# EAGLE design DDS_rev02 (EAGLE 6.5.0)
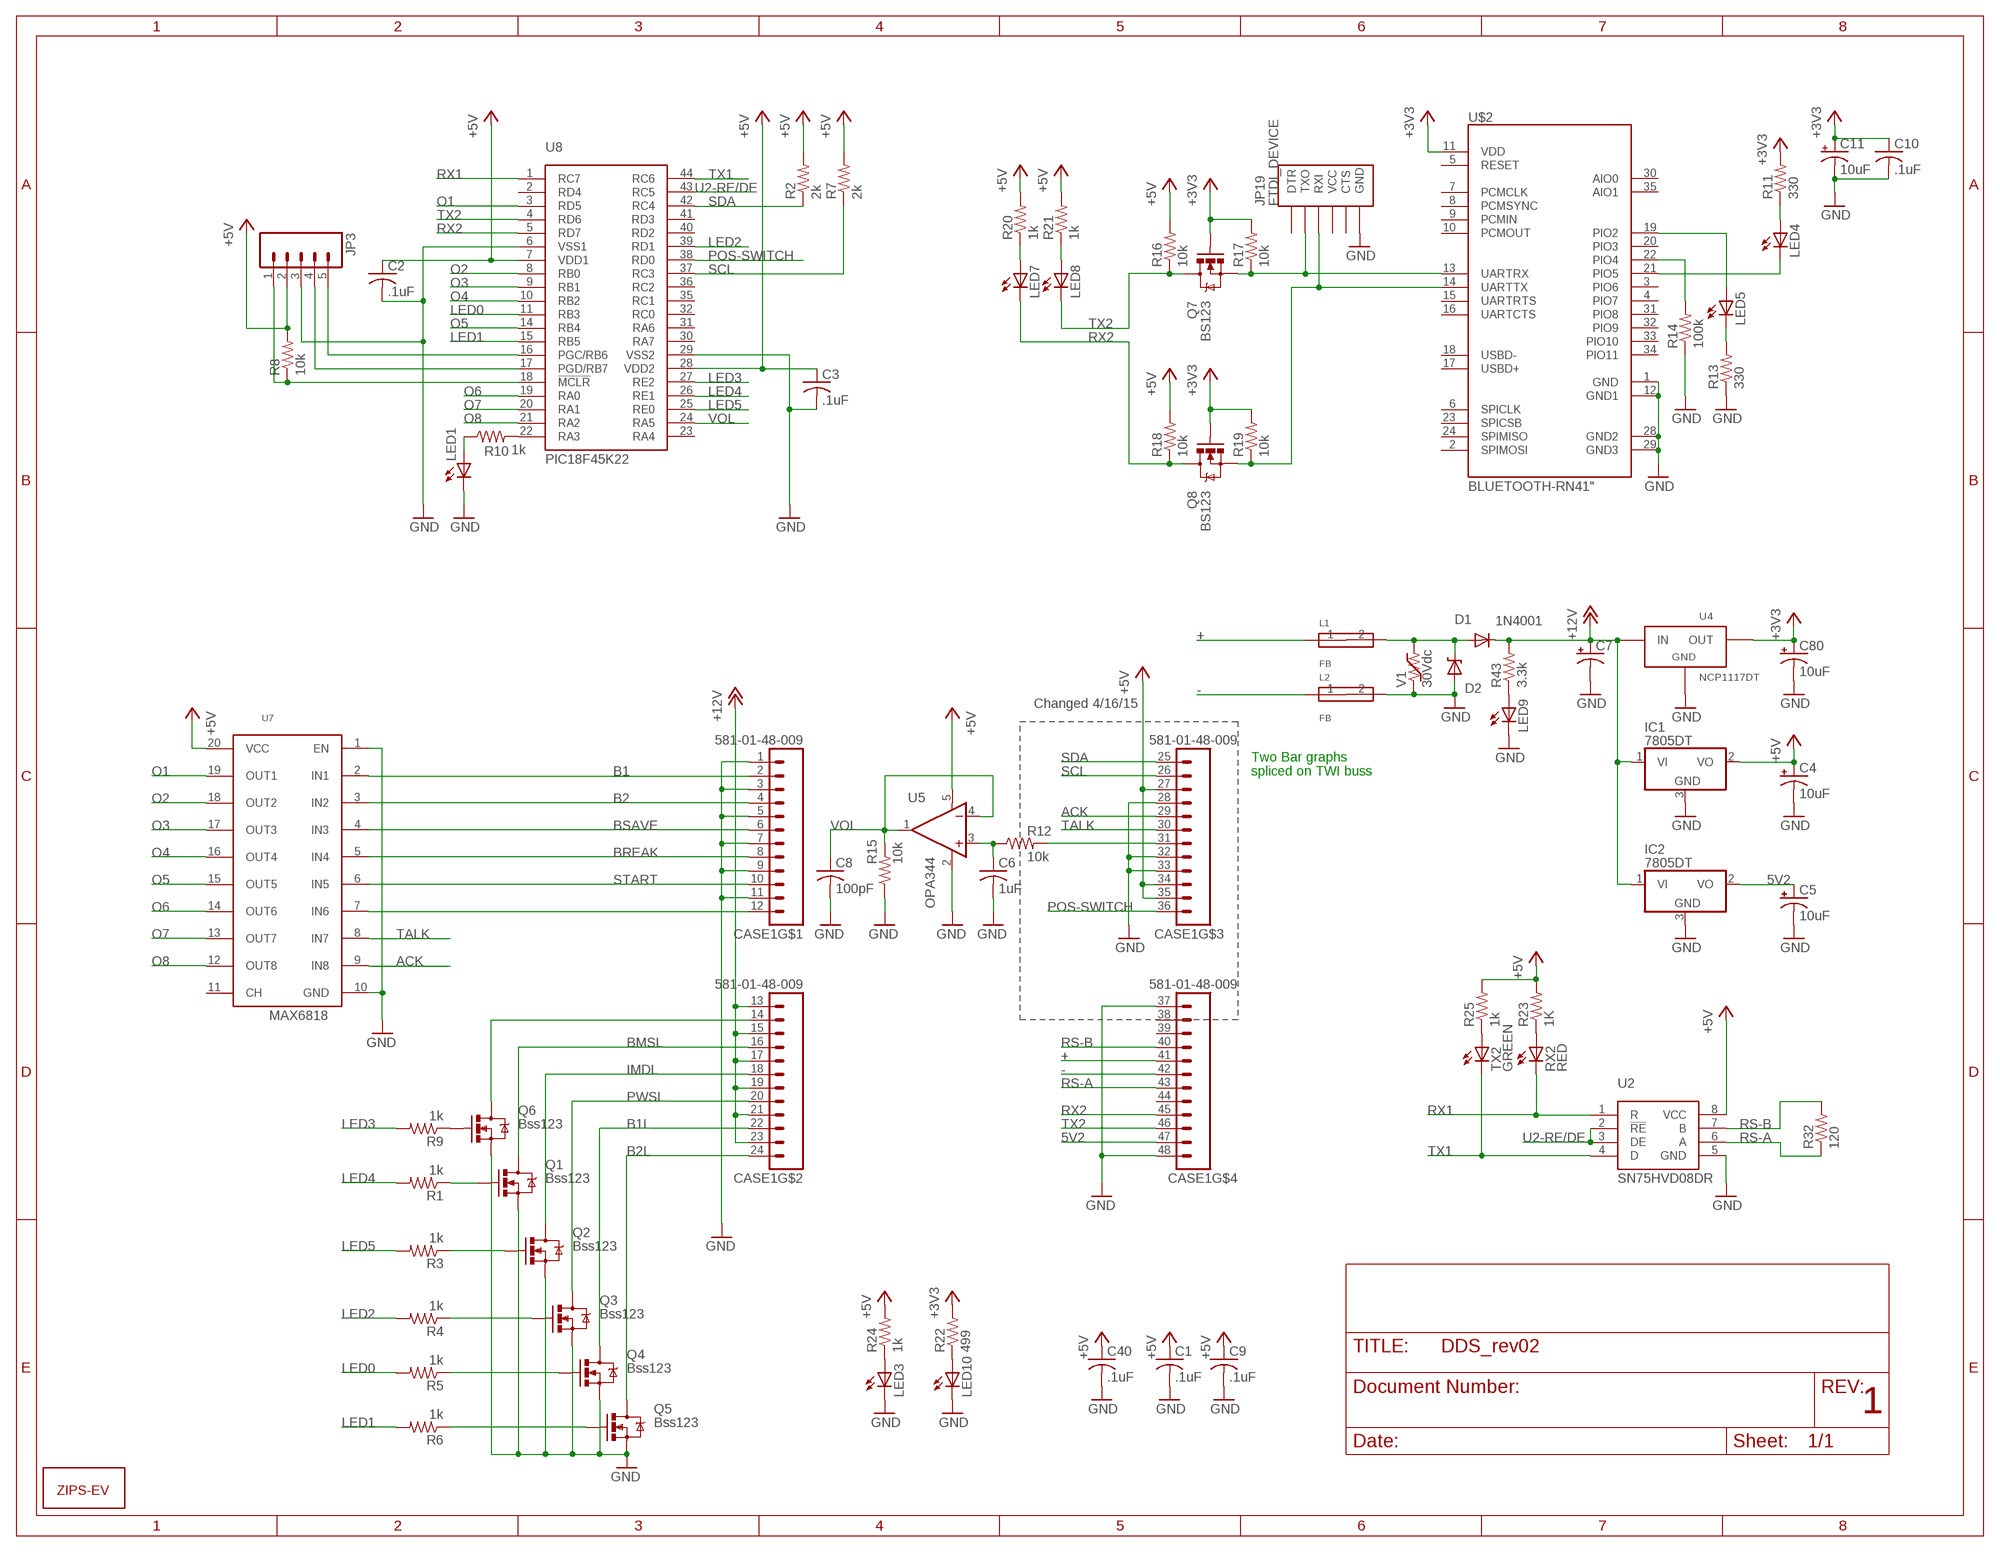
[diagram p0: schematic, sheet 1]

## Parts
C1  .1uF  C-USC0805  [C0805]
C2  .1uF  C-USC0805  [C0805]
C3  .1uF  C-USC0805  [C0805]
C4  10uF  POLCAP  [POLC1206]
C5  10uF  POLCAP  [POLC1206]
C6  1uF  C-USC0805  [C0805]
C7  CAP_POL7343  [EIA7343]
C8  100pF  C-USC0805  [C0805]
C9  .1uF  C-USC0805  [C0805]
C10  .1uF  C-USC0805  [C0805]
C11  10uF  POLCAP  [POLC1206]
C40  .1uF  C-USC0805  [C0805]
C80  10uF  POLCAP  [POLC1206]
CASE1  581-01-48-009  [581-01-48-009]
D1  1N4001  DIODE-SOD123  [SOD123]
D2  MM5Z30  [SOD-523F]
IC1  7805DT  [TO252]
IC2  7805DT  [TO252]
JP3  M05LOCK_LONGPADS  [1X05_LOCK_LONGPADS]
JP19  FTDI_DEVICE  [FTDI_DEVICE_SIDE]
L1  FB  FERITEBEAD  [0603]
L2  FB  FERITEBEAD  [0603]
LED1  LEDCHIP-LED0805  [CHIP-LED0805]
LED3  LEDCHIP-LED0805  [CHIP-LED0805]
LED4  LEDCHIP-LED0805  [CHIP-LED0805]
LED5  LEDCHIP-LED0805  [CHIP-LED0805]
LED7  LEDCHIP-LED0805  [CHIP-LED0805]
LED8  LEDCHIP-LED0805  [CHIP-LED0805]
LED9  LEDCHIP-LED0805  [CHIP-LED0805]
LED10  LEDCHIP-LED0805  [CHIP-LED0805]
Q1  Bss123  MOSFET-NCHANNELBSS123LT1G  [SOT23]
Q2  Bss123  MOSFET-NCHANNELBSS123LT1G  [SOT23]
Q3  Bss123  MOSFET-NCHANNELBSS123LT1G  [SOT23]
Q4  Bss123  MOSFET-NCHANNELBSS123LT1G  [SOT23]
Q5  Bss123  MOSFET-NCHANNELBSS123LT1G  [SOT23]
Q6  Bss123  MOSFET-NCHANNELBSS123LT1G  [SOT23]
Q7  BS123  MOSFET-NCHANNELBSS123LT1G  [SOT23]
Q8  BS123  MOSFET-NCHANNELBSS123LT1G  [SOT23]
R1  1k  R-US_R0805  [R0805]
R2  2k  R-US_R0805  [R0805]
R3  1k  R-US_R0805  [R0805]
R4  1k  R-US_R0805  [R0805]
R5  1k  R-US_R0805  [R0805]
R6  1k  R-US_R0805  [R0805]
R7  2k  R-US_R0805  [R0805]
R8  10k  RESISTOR0805-RES  [0805]
R9  1k  R-US_R0805  [R0805]
R10  1k  R-US_R0805  [R0805]
R11  330  RESISTOR0805-RES  [0805]
R12  10k  R-US_R0805  [R0805]
R13  330  RESISTOR0805-RES  [0805]
R14  100k  RESISTOR0805-RES  [0805]
R15  10k  R-US_R0805  [R0805]
R16  10k  RESISTOR0805-RES  [0805]
R17  10k  RESISTOR0805-RES  [0805]
R18  10k  RESISTOR0805-RES  [0805]
R19  10k  RESISTOR0805-RES  [0805]
R20  1k  RESISTOR0805-RES  [0805]
R21  1k  RESISTOR0805-RES  [0805]
R22  499  R-US_R0805  [R0805]
R23  1K  R-US_R0805  [R0805]
R24  1k  R-US_R0805  [R0805]
R25  1k  R-US_R0805  [R0805]
R32  120  R-US_R0805  [R0805]
R43  3.3k  R-US_R0805  [R0805]
RX2  RED  LEDCHIPLED_0805  [CHIPLED_0805]
TX2  GREEN  LEDCHIPLED_0805  [CHIPLED_0805]
U2  SN75HVD08DR  [SO-8]
U4  NCP1117DT  [DPAK]
U5  OPA344  [SOT23-5]
U7  MAX6818  [SSOP-20]
U8  PIC18F45K22  [TQFP-44]
U$1  LOGO  [L-L]
U$2  BLUETOOTH-RN41"  [RN41]
V1  30Vdc  VAR-RES  [0603]

## Nets
5V2: C5.1(+) CASE1.47 IC2.2(VO)
+: CASE1.41 L1.1
+3V3: C10.1 C11.1(+) C80.1(+) Q7.1(G) Q8.1(G) R11.2 R17.2 R19.2 R22.2 U4.2(OUT) U$2.11(VDD)
+5V: C1.1 C2.1 C3.1 C4.1(+) C9.1 C40.1 CASE1.27 CASE1.34 CASE1.35 IC1.2(VO) JP3.2 R2.2 R7.2 R8.2 R16.2 R18.2 R20.2 R21.2 R23.2 R24.2 R25.2 U2.8(VCC) U5.5(V+) U7.20(VCC) U8.7(VDD1) U8.28(VDD2)
+12V: C7.A(+) CASE1.13 CASE1.15 CASE1.17 CASE1.19 CASE1.21 CASE1.23 D1.C IC1.1(VI) IC2.1(VI) R43.2 U4.3(IN)
-: CASE1.42 L2.1
ACK: CASE1.29 U7.9(IN8)
B1: CASE1.2 U7.2(IN1)
B1L: CASE1.22 Q4.3(D)
B2: CASE1.4 U7.3(IN2)
B2L: CASE1.24 Q5.3(D)
BMSL: CASE1.16 Q1.3(D)
BREAK: CASE1.8 U7.5(IN4)
BSAVE: CASE1.6 U7.4(IN3)
GHT: D1.A D2.C L1.2 V1.2
GND: C1.2 C2.2 C3.2 C4.2(-) C5.2(-) C6.2 C7.C(-) C8.2 C9.2 C10.2 C11.2(-) C40.2 C80.2(-) CASE1.1 CASE1.3 CASE1.5 CASE1.7 CASE1.9 CASE1.11 CASE1.28 CASE1.32 CASE1.33 CASE1.37 CASE1.48 D2.A IC1.3(GND) IC2.3(GND) JP3.3 JP19.P$6(GND) L2.2 LED1.C LED3.C LED9.C LED10.C Q1.2(S) Q2.2(S) Q3.2(S) Q4.2(S) Q5.2(S) Q6.2(S) R13.1 R14.1 R15.1 U2.5(GND) U4.1(GND) U5.2(V-) U7.1(EN) U7.10(GND) U8.6(VSS1) U8.29(VSS2) U$2.1(GND) U$2.12(GND1) U$2.28(GND2) U$2.29(GND3) V1.1
IMDL: CASE1.18 Q2.3(D)
LED0: R5.2 U8.11(RB3)
LED1: R6.2 U8.15(RB5)
LED2: R4.2 U8.39(RD1)
LED3: R9.2 U8.27(RE2)
LED4: R1.2 U8.26(RE1)
LED5: R3.2 U8.25(RE0)
N$1: LED1.A R10.1
N$2: R10.2 U8.22(RA3)
N$3: JP19.P$3(RXI) Q8.2(S) R19.1 U$2.14(UARTTX)
N$4: CASE1.12 U7.7(IN6)
N$5: CASE1.14 Q6.3(D)
N$6: LED4.A R11.1
N$7: Q6.1(G) R9.1
N$8: LED4.C U$2.21(PIO5)
N$9: LED5.A U$2.19(PIO2)
N$10: R14.2 U$2.22(PIO4)
N$12: JP19.P$2(TXO) Q7.2(S) R17.1 U$2.13(UARTRX)
N$13: LED5.C R13.2
N$15: LED9.A R43.1
N$16: Q1.1(G) R1.1
N$17: LED7.A R20.1
N$18: LED8.A R21.1
N$19: LED10.A R22.1
N$20: Q2.1(G) R3.1
N$21: Q3.1(G) R4.1
N$22: Q4.1(G) R5.1
N$23: Q5.1(G) R6.1
N$24: CASE1.31 R12.2
N$25: LED3.A R24.1
N$26: C6.1 R12.1 U5.3(+IN)
N$31: R25.1 TX2.A
N$32: R23.1 RX2.A
N$40: JP3.4 U8.17(PGD/RB7)
N$43: JP3.5 U8.16(PGC/RB6)
N$46: JP3.1 R8.1 U8.18(!MCLR)
O1: U7.19(OUT1) U8.3(RD5)
O2: U7.18(OUT2) U8.8(RB0)
O3: U7.17(OUT3) U8.9(RB1)
O4: U7.16(OUT4) U8.10(RB2)
O5: U7.15(OUT5) U8.14(RB4)
O6: U7.14(OUT6) U8.19(RA0)
O7: U7.13(OUT7) U8.20(RA1)
O8: U7.12(OUT8) U8.21(RA2)
POS-SWITCH: CASE1.36 U8.38(RD0)
PWSL: CASE1.20 Q3.3(D)
RS-A: CASE1.43 R32.1 U2.6(A)
RS-B: CASE1.40 R32.2 U2.7(B)
RX1: RX2.C U2.1(R) U8.1(RC7)
RX2: CASE1.45 LED7.C Q8.3(D) R18.1 U8.5(RD7)
SCL: CASE1.26 R7.1 U8.37(RC3)
SDA: CASE1.25 R2.1 U8.42(RC4)
START: CASE1.10 U7.6(IN5)
TALK: CASE1.30 U7.8(IN7)
TX1: TX2.C U2.4(D) U8.44(RC6)
TX2: CASE1.46 LED8.C Q7.3(D) R16.1 U8.4(RD6)
U2-RE/DE: U2.2(!RE) U2.3(DE) U8.43(RC5)
VOL: C8.1 R15.2 U5.1(OUT) U5.4(-IN) U8.24(RA5)
Unconnected: CASE1.38 CASE1.39 CASE1.44 JP19.P$1(DTR) JP19.P$4(VCC) JP19.P$5(CTS) U7.11(CH) U8.2(RD4) U8.23(RA4) U8.30(RA7) U8.31(RA6) U8.32(RC0) U8.35(RC1) U8.36(RC2) U8.40(RD2) U8.41(RD3) U$2.2(SPIMOSI) U$2.3(PIO6) U$2.4(PIO7) U$2.5(RESET) U$2.6(SPICLK) U$2.7(PCMCLK) U$2.8(PCMSYNC) U$2.9(PCMIN) U$2.10(PCMOUT) U$2.15(UARTRTS) U$2.16(UARTCTS) U$2.17(USBD+) U$2.18(USBD-) U$2.20(PIO3) U$2.23(SPICSB) U$2.24(SPIMISO) U$2.30(AIO0) U$2.31(PIO8) U$2.32(PIO9) U$2.33(PIO10) U$2.34(PIO11) U$2.35(AIO1)

## Notes on the sheet
- Changed 4/16/15
- Two Bar graphs 
  spliced on TWI buss
- 1

## Library data of the parts
C1-C3 C6 C8-C10 C40 = adafruit:C-US: CAPACITOR, American symbol
C4 C5 C11 C80 = RJ's_parts:POLCAP
C7 = SparkFun-Capacitors:CAP_POL: Capacitor Polarized These are standard SMD and PTH capacitors. Normally 10uF, 47uF, and 100uF in electrolytic and tantalum varieties. Always verify the external diameter of the through hole cap, it varies with capacity, voltage, and manufacturer. The EIA devices should be standard.
CASE1 = FSAE Eletric:581-01-48-009
D1 = diode:DIODE-: DIODE
D2 = EmEndev:MM5Z30
IC1 IC2 = adafruit:78*: Positive VOLTAGE REGULATOR Added bigger pads to the TO-92 package
JP3 = SparkFun-Connectors:M05: Header 5 Standard 5-pin 0.1" header. Use with straight break away headers (SKU : PRT-00116), right angle break away headers (PRT-00553), swiss pins (PRT-00743), machine pins (PRT-00117), and female headers (PRT-00115). Molex polarized connector foot print use with SKU : PRT-08230 with associated crimp pins and housings.
JP19 = SparkFun-Connectors:FTDI_DEVICE: Connector which mates to FTDI basic or FTDI cable.
L1 L2 = EmEndev:FERITEBEAD
LED1 LED3 LED9 LED10 RX2 TX2 = adafruit:LED: LED
LED4 LED5 LED7 LED8 = led:LED: LED
Q1-Q8 = SparkFun-DiscreteSemi:MOSFET-NCHANNEL: Common NMOSFET Parts MFG P/N Store ID Prod ID FDD8780 TRANS-09984 SI7820DN TRANS-11055 FDS6630A IC-08089 2N7002PW TRANS-11151 FQP30N06L COM-10213 TRANS-10060 BSS123LT1G TRANS-08345 BSS138 TRANS-00830 BS170 2N7000; PROD_ID: TRANS-08345
R1-R7 R9 R10 R12 R15 R22-R25 R32 R43 = adafruit:R-US_: RESISTOR, American symbol
R8 R11 R13 R14 R16-R21 = SparkFun-Passives:RESISTOR: Resistor Basic schematic elements and footprints for 0603, 1206, and PTH resistors.
U2 = FSAE Eletric:SN75HVD08DR
U4 = FSAE Eletric:NCP1117DT
U5 = SparkFun-AnalogIC:OPA344: Single gate rail-to-rail output op-amp. Inputs extend 300mV past rails.
U7 = NASA_LIB:MAX6818
U8 = FSAE Eletric:PIC18F45K22
U$1 = untitled:LOGO
U$2 = SparkFun-RF:BLUETOOTH-RN41: Bluetooth SMD module
V1 = EmEndev:VAR-RES

## Board
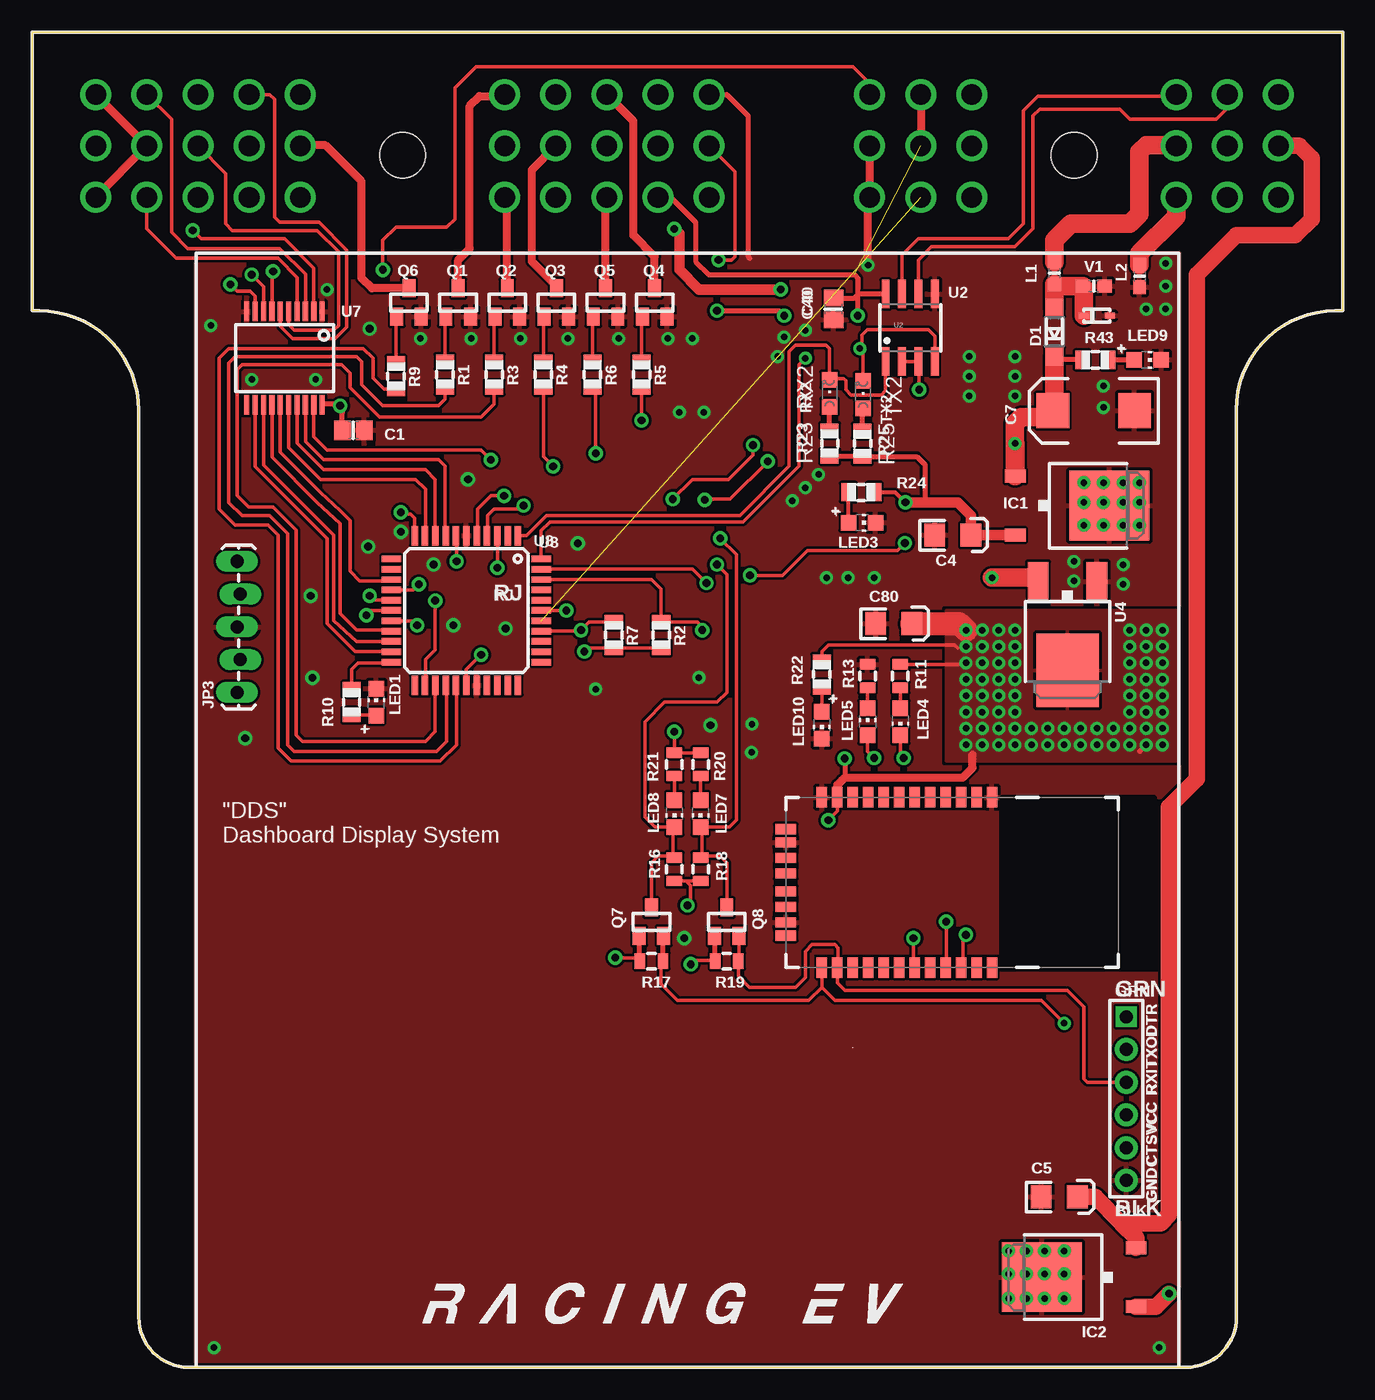
[diagram p1: board, top side]
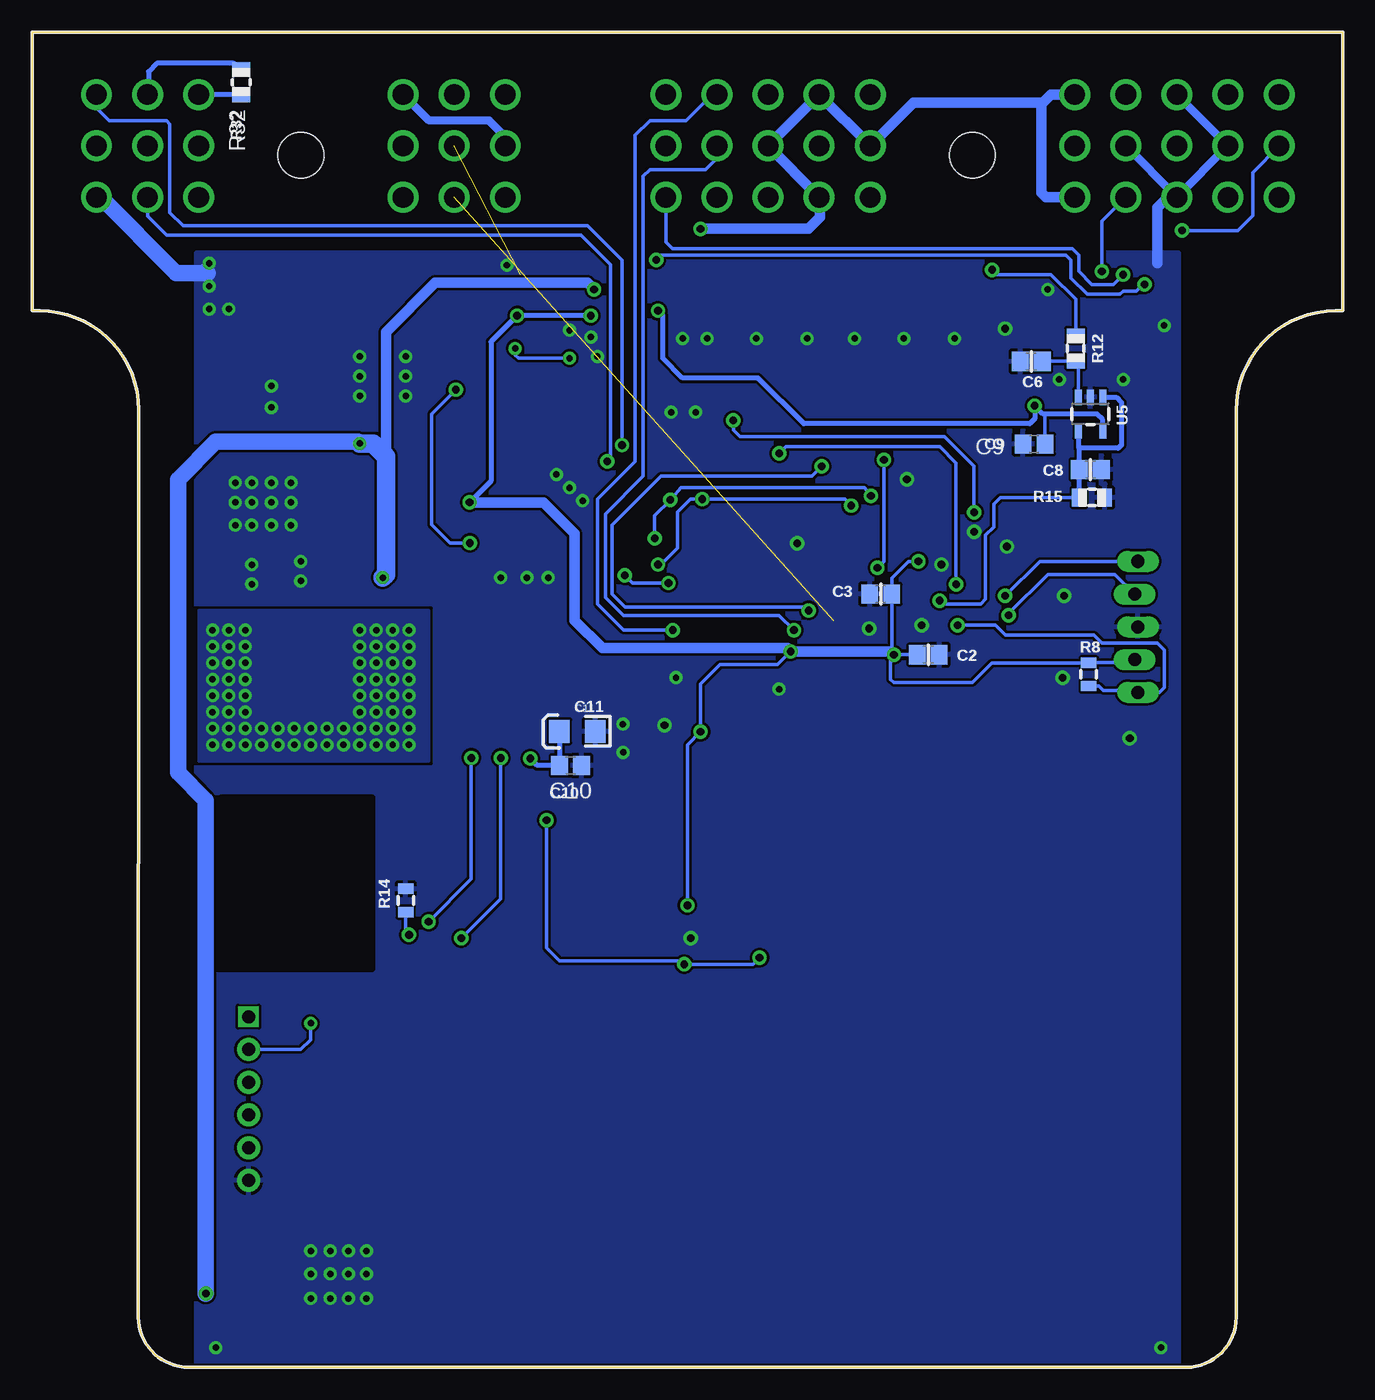
[diagram p2: board, bottom side, seen from below]

Size 101.6 x 103.51 mm. Coordinates in mm from the lower left corner, seen from the top.
Copper layers (1*16): Top 0.035mm / dielectric 1.5mm / Bottom 0.035mm
Design rules "SparkFun": minimum track width 8mil, minimum drill 20mil, track to track 8mil, track to pad 8mil, pad to pad 8mil, via to via 8mil, smd to smd 8mil, copper to edge 10mil, drill to drill 8mil, minimum pad ring 12mil, minimum via ring 10mil, stop-mask expansion 4mil, vias tented up to drill 25mil, thermal gap 10mil
tRestrict: area 75.2,30.9 to 87,44.2
bRestrict: area 75.2,30.9 to 87,44.2

### Footprints (pad centres in the part's own frame; a part is rotated, then mirrored left to right if it is on the bottom)
C0805 = smd 1.3 x 1.5: 1 -0.85,0; 2 0.85,0
POLC1206 = smd 1.6 x 1.8: 1 -1.4,0; 2 1.4,0
EIA7343 = smd 2.55 x 2.7: A 3.17,0; C -3.17,0
581-01-48-009 = drill 1.6: 1 -45.872,4.699; 2 -45.872,0.711; 3 -45.872,-3.277; 4 -41.91,4.699; 5 -41.91,0.711; 6 -41.91,-3.277; 7 -37.948,4.699; 8 -37.948,0.711; 9 -37.948,-3.277; 10 -33.985,4.699; 11 -33.985,0.711; 12 -33.985,-3.277; 13 -30.023,4.699; 14 -30.023,0.711; 15 -30.023,-3.277; 16 -14.173,4.699; 17 -14.173,0.711; 18 -14.173,-3.277; 19 -10.211,4.699; 20 -10.211,0.711; 21 -10.211,-3.277; 22 -6.248,4.699; 23 -6.248,0.711; 24 -6.248,-3.277; 25 -2.286,4.699; 26 -2.286,0.711; 27 -2.286,-3.277; 28 1.676,4.699; 29 1.676,0.711; 30 1.676,-3.277; 31 14.122,4.699; 32 14.122,0.711; 33 14.122,-3.277; 34 18.085,4.699; 35 18.085,0.711; 36 18.085,-3.277; 37 22.047,4.699; 38 22.047,0.711; 39 22.047,-3.277; 40 37.897,4.699; 41 37.897,0.711; 42 37.897,-3.277; 43 41.859,4.699; 44 41.859,0.711; 45 41.859,-3.277; 46 45.822,4.699; 47 45.822,0.711; 48 45.822,-3.277 | hole 3.556: -22.098,0; 29.972,0
SOD123 = smd 1.4 x 1.4: A 1.9,0; C -1.9,0
SOD-523F = smd 0.8 x 0.5: A -1,0; C 1,0
TO252 = smd 1 x 1.6: 1 -2.28,-4.8; 2 2.28,-4.8 | smd 5.4 x 6.2: 3 0,2.5
1X05_LOCK_LONGPADS = drill 1.016 long: 1 0,0; 2 2.54,-0.254; 3 5.08,0; 4 7.62,-0.254; 5 10.16,0
FTDI_DEVICE_SIDE = drill 1 square: P$1 -6.35,0 | drill 1.016 pad 1.778: P$2 -3.81,0; P$3 -1.27,0; P$4 1.27,0; P$5 3.81,0; P$6 6.35,0
0603 = smd 1.1 x 1: 1 -0.85,0; 2 0.85,0
CHIP-LED0805 = smd 1.2 x 1.2: A 0,-1.05; C 0,1.05
SOT23 = smd 1 x 1.4: 1 -0.95,-1.1; 2 0.95,-1.1; 3 0,1.1
R0805 = smd 1.1 x 1.4: 1 -1,0; 2 1,0
0805 = smd 0.8 x 1.2: 1 -0.9,0; 2 0.9,0
CHIPLED_0805 = smd 1.2 x 1.2: A 0,-1.05; C 0,1.05
SO-8 = smd 0.61 x 2.21: 1 -1.905,-2.616; 2 -0.635,-2.616; 3 0.635,-2.616; 4 1.905,-2.616; 5 1.905,2.616; 6 0.635,2.616; 7 -0.635,2.616; 8 -1.905,2.616
DPAK = smd 1.6 x 3: 1 -2.28,-4.04; 3 2.28,-4.04 | smd 4.826 x 5.715: 2 0,2.858
SOT23-5 = smd 0.55 x 1.2: 1 -0.95,-1.3; 2 0,-1.3; 3 0.95,-1.3; 4 0.95,1.3; 5 -0.95,1.3
SSOP-20 = smd 0.4 x 1.5: 1 -2.925,-3.625; 2 -2.275,-3.625; 3 -1.625,-3.625; 4 -0.975,-3.625; 5 -0.325,-3.625; 6 0.325,-3.625; 7 0.975,-3.625; 8 1.625,-3.625; 9 2.275,-3.625; 10 2.925,-3.625; 11 2.925,3.625; 12 2.275,3.625; 13 1.625,3.625; 14 0.975,3.625; 15 0.325,3.625; 16 -0.325,3.625; 17 -0.975,3.625; 18 -1.625,3.625; 19 -2.275,3.625; 20 -2.925,3.625
TQFP-44 = smd 1.5 x 0.5: 1 -5.8,4; 2 -5.8,3.2; 3 -5.8,2.4; 4 -5.8,1.6; 5 -5.8,0.8; 6 -5.8,0; 7 -5.8,-0.8; 8 -5.8,-1.6; 9 -5.8,-2.4; 10 -5.8,-3.2; 11 -5.8,-4; 23 5.8,-4; 24 5.8,-3.2; 25 5.8,-2.4; 26 5.8,-1.6; 27 5.8,-0.8; 28 5.8,0; 29 5.8,0.8; 30 5.8,1.6; 31 5.8,2.4; 32 5.8,3.2; 33 5.8,4 | smd 0.5 x 1.5: 12 -4,-5.8; 13 -3.2,-5.8; 14 -2.4,-5.8; 15 -1.6,-5.8; 16 -0.8,-5.8; 17 0,-5.8; 18 0.8,-5.8; 19 1.6,-5.8; 20 2.4,-5.8; 21 3.2,-5.8; 22 4,-5.8; 34 4,5.8; 35 3.2,5.8; 36 2.4,5.8; 37 1.6,5.8; 38 0.8,5.8; 39 0,5.8; 40 -0.8,5.8; 41 -1.6,5.8; 42 -2.4,5.8; 43 -3.2,5.8; 44 -4,5.8
RN41 = smd 0.8 x 1.6: 1 -6.6,-6.6; 2 -5.4,-6.6; 3 -4.2,-6.6; 4 -3,-6.6; 5 -1.8,-6.6; 6 -0.6,-6.6; 7 0.6,-6.6; 8 1.8,-6.6; 9 3,-6.6; 10 4.2,-6.6; 11 5.4,-6.6; 12 6.6,-6.6; 13 6.6,6.6; 14 5.4,6.6; 15 4.2,6.6; 16 3,6.6; 17 1.8,6.6; 18 0.6,6.6; 19 -0.6,6.6; 20 -1.8,6.6; 21 -3,6.6; 22 -4.2,6.6; 23 -5.4,6.6; 24 -6.6,6.6 | smd 1.6 x 0.8: 28 9.4,3.1; 29 9.4,-3.1; 30 9.4,4.122; 31 9.4,1.9; 32 9.4,0.7; 33 9.4,-0.7; 34 9.4,-1.9; 35 9.4,-4.122

### Placement (x,y rotation side)
C1  24.89,72.64 0 top
C2  32.13,55.24 0 bottom
C3  35.81,59.94 180 bottom
C4  71.37,64.52 180 top
C5  79.63,13.21 180 top
C6  24.13,77.98 180 bottom
C7  82.3,74.17 180 top
C8  19.56,69.6 0 bottom
C9  23.93,71.58 180 bottom
C10  59.87,46.66 0 bottom
C11  59.33,49.3 0 bottom
C40  62.13,82.05 270 top
C80  66.8,57.66 180 top
CASE1  50.8,93.98 0 top
D1  79.25,80.26 90 top
D2  82.55,81.53 180 top
IC1  81.03,66.8 270 top
IC2  80.77,6.99 90 top
JP3  15.87,52.32 90 top
JP19  84.84,20.83 270 top
L1  79.25,84.84 270 top
L2  85.85,84.58 270 top
LED1  26.67,51.56 0 top
LED3  64.34,65.48 270 top
LED4  67.31,50.04 180 top
LED5  64.77,50.04 0 top
LED7  51.82,42.93 180 top
LED8  49.78,42.93 180 top
LED9  86.49,78.11 270 top
LED10  61.21,49.78 180 top
Q1  33.02,82.55 0 top
Q2  36.83,82.55 0 top
Q3  40.64,82.55 0 top
Q4  48.26,82.55 0 top
Q5  44.45,82.55 0 top
Q6  29.21,82.55 0 top
Q7  48.01,34.54 0 top
Q8  53.85,34.54 0 top
R1  32,76.96 270 top
R2  48.77,56.77 270 top
R3  35.81,76.96 270 top
R4  39.62,76.96 270 top
R5  47.24,76.96 270 top
R6  43.43,76.96 270 top
R7  45.08,56.77 270 top
R8  19.68,53.72 90 bottom
R9  28.19,76.83 270 top
R10  24.76,51.56 90 top
R11  67.31,53.59 90 top
R12  20.7,78.99 90 bottom
R13  64.77,53.59 270 top
R14  72.64,36.2 270 bottom
R15  19.43,67.44 180 bottom
R16  49.78,38.61 270 top
R17  48.01,31.5 180 top
R18  51.82,38.61 270 top
R19  53.85,31.5 180 top
R20  51.82,46.74 90 top
R21  49.78,46.74 90 top
R22  61.21,53.72 90 top
R23  61.82,71.63 270 top
R24  64.29,67.84 0 top
R25  64.36,71.6 270 top
R32  85.39,99.64 270 bottom
R43  82.42,78.11 180 top
RX2  61.82,75.51 0 top
TX2  64.41,75.41 0 top
U2  68.07,80.59 0 top
U4  80.26,56.9 180 top
U5  19.56,73.91 180 bottom
U7  19.56,78.23 180 top
U8  33.65,58.67 270 top
U$1  15.24,-0.64 0 top
U$2  67.82,37.59 180 top
V1  82.3,83.82 180 top

### Tracks (layer width: path | path; a pad name or v marks a point on that pad's centre or on a via)
5V2
  Top 1.27: 84.45,11.18 85.6,10.03 85.6,9.29 IC2.2 | C5.1 82.42,13.21 84.45,11.18 | 84.45,11.18 87.5,11.18 88.14,11.81 88.14,43.43 90.3,45.59 90.3,84.71 93.34,87.76 97.92,87.76 99.19,89.03 99.19,93.73 98.22,94.69 CASE1.47
+
  Top 1.422: L1.1 79.25,87.38 80.52,88.65 85.09,88.65 85.85,89.41 85.85,94.23 86.36,94.74 88.65,94.74 CASE1.41
+3V3  (via drill 0.5, 0.6)
  Top 0.254: 52.9,31.55 51.36,31.55 v51.05,31.24 | v45.21,31.75 46.85,31.75 R17.2 | U$2.11 62.42,43.11 v61.72,42.42 | R11.2 72.27,54.49 v72.39,54.61 | R22.2 61.21,55.5 61.72,56.01 71.5,56.01 71.75,55.75
  Top 0.406: 85.85,47.75 v86.36,48.26 | Q8.1 52.9,31.55 R19.2 | Q7.1 47.06,31.55 R17.2 | v62.99,47.19 62.99,45.72
  Top 0.61: U$2.11 62.42,45.15 62.78,45.5 62.99,45.72 72.14,45.72 72.9,46.48 72.9,47.5
  Top 1.778: C80.1 71.88,57.66 v72.39,57.15
  Bottom 0.254: v45.21,31.75 45.72,31.24 v51.05,31.24 51.31,31.5 60.71,31.5 61.72,32.51 v61.72,42.42
  Bottom 0.406: C11.1 60.72,49.3 C10.1 62.46,46.66 v62.99,47.19
  other vias: 73.66,57.15 74.93,57.15 76.2,57.15 76.2,55.88 74.93,55.88 73.66,55.88 72.39,55.88 73.66,54.61 74.93,54.61 76.2,54.61 76.2,53.34 74.93,53.34 73.66,53.34 72.39,53.34 72.39,52.07 73.66,52.07 74.93,52.07 76.2,52.07 76.2,50.8 74.93,50.8 73.66,50.8 72.39,50.8 72.39,49.53 73.66,49.53 74.93,49.53 76.2,49.53 76.2,48.26 74.93,48.26 73.66,48.26 72.39,48.26 77.47,49.53 78.74,49.53 80.01,49.53 81.28,49.53 81.28,48.26 80.01,48.26 78.74,48.26 77.47,48.26 82.55,49.53 83.82,49.53 85.09,49.53 86.36,49.53 85.09,48.26 83.82,48.26 82.55,48.26 85.09,53.34 85.09,54.61 85.09,55.88 85.09,57.15 86.36,57.15 86.36,55.88 86.36,54.61 86.36,53.34 85.09,52.07 86.36,52.07 87.63,57.15 87.63,55.88 87.63,54.61 87.63,53.34 87.63,52.07 87.63,50.8 86.36,50.8 85.09,50.8 87.63,49.53 87.63,48.26
  pour Top: 70.87,58.67 88.9,58.67 88.65,46.99 70.87,46.99
  pour Bottom: 70.87,58.67 88.65,58.67 88.65,46.99 70.87,46.99
+5V  (via drill 0.6)  (1 unrouted)
  Top 0.254: R18.2 R16.2 50.68,37.71 51.05,37.34 51.05,36.07 v50.8,35.81 | v49.78,49.28 R21.2 R20.2 | U8.28 33.65,54.1 v34.8,55.24 | v32.89,62.48 32.89,64.39 U8.7 | R2.2 R7.2 43.07,55.77 v42.8,55.5
  Top 0.305: R24.2 66.9,67.84 v67.69,67.06
  Top 0.406: CASE1.27 49.5,90.7 51.43,88.77 51.43,85.72 52.45,84.71 63.75,84.71 64.02,84.42 | 64.02,84.42 64.03,83.64 | 23.75,74.3 23.37,74.68 22.55,74.68 U7.20 | C1.1 24.04,74 23.75,74.3 | 23.75,74.3 23.75,74.42 v23.88,74.55 | v53.09,81.92 57.91,81.92 v58.29,81.53 | v64.01,81.53 64.01,83.16 | 64.01,83.16 64.01,83.34 | 64.01,83.34 64.01,84.07 64.02,84.42 | U2.8 64.03,83.19 64.01,83.34 | R23.2 64.34,70.63 R25.2 68.59,70.6 69.22,69.98 69.22,67.23 69.04,67.06 | C40.1 63.75,82.91 64.01,83.16
  Top 0.61: CASE1.34 CASE1.35
  Top 0.813: IC1.2 C4.1 72.77,66.04 71.75,67.06 69.04,67.06 v67.69,67.06
  Bottom 0.254: v50.8,35.81 50.8,48.26 v49.78,49.28 49.78,52.96 48.26,54.48 43.81,54.48 v42.8,55.5 | v34.8,55.24 C2.1 | v34.8,55.24 34.96,55.41 C3.1 34.96,61.17 33.65,62.48 v32.89,62.48 | v34.8,55.24 35.05,54.99 35.05,53.34 34.8,53.09 28.7,53.09 27.18,54.61 R8.2 16.37,54.62 JP3.2 | C9.1 23.08,73.77 22.94,73.91
  Bottom 0.406: v53.09,81.92 52.7,81.53 52.7,78.23 51.18,76.71 45.34,76.71 41.78,73.15 24.26,73.15 23.88,73.53 v23.88,74.55 23.24,73.91 22.94,73.91 19.05,73.91 18.61,73.47 U5.5 | v58.29,81.53 v64.01,81.53 66.04,79.5 66.04,68.71 v67.69,67.06
  Bottom 0.813: v67.69,67.06 61.98,67.06 59.56,64.64 59.56,57.91 57.4,55.75 43.05,55.75 v42.8,55.5 35.05,55.5 v34.8,55.24
+12V  (via drill 0.5, 0.6)
  Top 0.406: R43.2 79.51,78.11 D1.C
  Top 0.813: v58.04,83.57 51.69,83.57 50.16,85.09 50.16,87.88 v49.78,88.27
  Top 1.27: IC2.1 87.13,4.71 v88.14,5.71
  Top 1.422: D1.C 79.25,73.91 78.99,73.66 | 78.99,73.66 78.99,74.04 C7.A | 78.99,73.66 76.71,73.66 76.2,73.15 v76.2,71.63 | v76.2,71.63 76.2,69.11 IC1.1 76.23,71.6 v76.2,71.63 | v74.42,61.21 77.71,61.21 U4.3
  Bottom 0.813: CASE1.15 23.01,90.7 23.37,91.06 23.37,97.92 | 23.37,97.92 22.61,98.68 CASE1.13 | CASE1.17 36.63,94.72 | 36.63,94.72 CASE1.19 40.59,98.65 CASE1.23 40.59,90.73 CASE1.21 40.51,90.63 40.51,89.15 41.4,88.27 v49.78,88.27 | 36.63,94.72 36.6,94.72 33.27,98.04 23.49,98.04 23.37,97.92 | 74.17,70.61 74.17,80.26 70.36,84.07 58.55,84.07 v58.04,83.57
  Bottom 1.27: v88.14,5.71 88.14,43.94 90.3,46.1 90.3,68.83 87.38,71.75 76.33,71.75 v76.2,71.63
  Bottom 1.422: v76.2,71.63 75.18,71.63 74.17,70.61 74.17,61.47 v74.42,61.21
-
  Top 1.422: CASE1.42 88.7,89.2 85.85,86.36 L2.1
ACK  (via drill 0.6)
  Top 0.254: U7.9 17.28,83.05 16.89,83.44 15.87,83.44 v15.37,83.95 | v53.21,85.85 54.23,85.85 54.48,86.11 54.48,92.69 CASE1.29
  Bottom 0.254: v15.37,83.95 15.49,83.95 16,83.44 17.02,83.44 17.27,83.19 19.81,83.19 21.08,84.45 21.08,85.85 21.46,86.23 52.83,86.23 v53.21,85.85
B1  (via drill 0.6)
  Top 0.254: U7.2 21.83,85.23 19.56,87.5 13.08,87.5 v12.45,88.14
  Bottom 0.254: v12.45,88.14 8.13,88.14 6.98,89.28 6.98,92.63 CASE1.2
B1L
  Top 0.61: Q4.3 48.26,86.11 46.61,87.76 46.61,96.62 CASE1.22
B2
  Top 0.254: U7.3 21.18,84.73 19.18,86.74 12.06,86.74 10.79,88.01 10.79,96.77 CASE1.4
B2L
  Top 0.61: Q5.3 44.45,90.6 CASE1.24
BMSL
  Top 0.61: Q1.3 33.02,85.85 33.91,86.74 33.91,97.79 34.67,98.55 36.5,98.55 CASE1.16
BREAK
  Top 0.254: U7.5 19.88,80.83 20.32,80.39 23.37,80.39 23.75,80.77 23.75,86.49 22.1,88.14 15.49,88.14 14.99,88.65 14.99,92.56 CASE1.8
BSAVE
  Top 0.254: U7.4 20.53,84.5 19.05,85.98 11.18,85.98 8.89,88.27 CASE1.6
GHT
  Top 1.422: D1.A L1.2 79.41,83.82 V1.2 81.55,83.72 D2.C
GND  (via drill 0.5, 0.6)
  Top 0.406: CASE1.28 53.85,98.68 55.5,97.03 55.5,86.11 55.63,85.98
  Top 0.61: CASE1.3 4.93,90.73 CASE1.5 4.93,98.65 CASE1.1 | CASE1.32 CASE1.33 64.77,90.55 64.77,85.47 v64.79,85.45
  Bottom 0.61: CASE1.9 12.85,90.73 | 12.85,90.73 CASE1.5 8.89,94.72 CASE1.7 | 12.85,90.73 CASE1.11 | CASE1.32 64.92,95.4 66.17,96.65 70.81,96.65 CASE1.37
  Bottom 0.813: CASE1.9 13.56,90.7 14.35,89.92 14.35,85.6
  Bottom 1.27: CASE1.48 96.29,90.7 90.42,84.84 88.14,84.84 | 88.01,84.84 88.14,84.84 | 88.14,84.84 88.14,84.96
  other vias: 87.88,85.6 87.88,83.82 87.88,82.04 86.36,82.04 84.58,62.23 84.58,60.71 80.77,62.48 80.77,60.96 81.53,68.58 83.06,68.58 84.58,68.58 85.85,68.58 85.85,67.06 84.58,67.06 83.06,67.06 81.53,67.06 81.53,65.28 83.06,65.28 84.58,65.28 85.85,65.28 50.55,33.27 52.58,49.78 21.72,53.47 21.59,59.82 26.03,63.63 32.64,57.53 36.7,57.28 52.07,74.04 58.29,79.88 58.93,67.18 13.84,80.77 57.78,78.36 59.94,80.39 49.28,79.76 45.47,79.76 41.53,79.76 37.85,79.76 34.04,79.76 30.1,79.76 51.18,79.76 50.16,74.04 59.94,68.2 60.96,69.22 61.59,61.21 63.25,61.21 65.28,61.21 76.2,78.36 76.2,76.83 76.2,75.31 72.64,78.36 72.64,76.83 72.64,75.31 31.11,62.23 28.57,64.77 33.78,68.83 42.29,63.88 16.51,48.77 26.16,80.52 83.06,76.07 83.06,74.42 43.69,52.58 51.69,53.47 55.78,47.68 55.8,49.86 14.1,1.52 87.38,1.52 75.69,9.02 77.09,9.02 78.49,9.02 80.01,9.02 75.69,7.24 77.09,7.24 78.49,7.24 80.01,7.24 75.69,5.33 77.09,5.33 78.49,5.33 80.01,5.33 17.02,76.58 21.97,76.58 22.86,83.57
  pour Bottom (rank 4): 12.7,86.36 88.9,86.36 88.9,0 12.7,0
  pour Top (rank 4): 12.7,86.36 88.9,86.36 88.9,0 12.7,0
IMDL
  Top 0.61: Q2.3 36.83,90.5 CASE1.18
LED0  (via drill 0.6)
  Top 0.254: U8.11 29.65,65.85 29.34,66.17 28.7,66.17 v28.57,66.29 | v47.24,73.41 R5.2
  Bottom 0.254: v28.57,66.29 28.57,69.85 30.86,72.14 46.74,72.14 47.24,72.64 v47.24,73.41
LED1  (via drill 0.6)
  Top 0.254: U8.15 29.54,60.27 v29.97,60.71 | v43.69,70.87 43.69,75.71 R6.2
  Bottom 0.254: v29.97,60.71 29.97,70.1 31.24,71.37 43.18,71.37 v43.69,70.87
LED2  (via drill 0.6)
  Top 0.254: R4.2 39.62,70.61 v40.39,69.85 | v41.4,58.67 U8.39
  Bottom 0.254: v40.39,69.85 41.15,69.09 52.83,69.09 56.64,65.28 56.64,59.94 55.63,58.93 41.66,58.93 v41.4,58.67
LED3
  Top 0.254: R9.2 27.29,75.83 26.42,76.71 26.42,78.23 25.65,78.99 15.24,78.99 14.48,78.23 14.48,66.55 15.75,65.28 18.29,65.28 19.05,64.52 19.05,48.01 20.07,46.99 31.62,46.99 32.89,48.26 32.89,52.58 U8.27
LED4
  Top 0.254: R1.2 32,75.06 31.5,74.55 27.18,74.55 25.53,76.2 25.53,77.98 25.15,78.36 15.75,78.36 15.24,77.85 15.24,67.06 16.26,66.04 18.41,66.04 19.81,64.64 19.81,48.26 20.32,47.75 31.37,47.75 32.13,48.51 32.13,52.8 U8.26
LED5
  Top 0.254: R3.2 35.81,74.68 34.8,73.66 26.92,73.66 24.64,75.95 24.64,77.09 24,77.72 16.26,77.72 15.87,77.34 15.87,67.56 16.76,66.67 18.67,66.67 20.45,64.9 20.45,49.02 20.95,48.51 30.48,48.51 31.24,49.28 U8.25
N$1
  Top 0.254: R10.1 26.62,50.56 LED1.A
N$2
  Top 0.254: R10.2 24.76,54.1 25.27,54.61 27.79,54.61 U8.22
N$3
  Top 0.254: Q8.2 54.8,31.55 R19.1 54.75,30.34 55.63,29.46 59.18,29.46 59.94,30.23 59.94,32.26 60.45,32.77 62.23,32.77 62.48,32.51 62.48,31.06 U$2.14 62.42,29.78 62.99,29.21 80.26,29.21 81.53,27.94 81.53,22.35 81.79,22.1 JP19.P$3
N$4  (via drill 0.6)
  Top 0.254: U7.7 18.58,84.88 v18.67,84.96
  Bottom 0.254: v18.67,84.96 18.67,88.85 CASE1.12
N$5
  Top 0.61: Q6.3 26.33,83.65 25.53,84.45 25.53,91.95 22.73,94.74 20.83,94.74 CASE1.14
N$6
  Top 0.254: LED4.A R11.1
N$7
  Top 0.254: R9.1 28.19,81.38 Q6.1
N$8  (via drill 0.6)
  Top 0.254: LED4.C 67.31,47.5 v67.56,47.24 | v70.87,34.54 70.87,31.04 U$2.21
  Bottom 0.254: v67.56,47.24 67.56,37.85 v70.87,34.54
N$9  (via drill 0.6)
  Top 0.254: LED5.A 64.77,47.75 v65.28,47.24 | v68.33,33.27 68.33,31.08 U$2.19
  Bottom 0.254: v65.28,47.24 65.28,36.32 v68.33,33.27
N$10  (via drill 0.6)
  Top 0.254: v72.39,33.53 72.14,33.27 72.14,31.11 U$2.22
  Bottom 0.254: R14.2 72.64,33.78 v72.39,33.53
N$12  (via drill 0.5)
  Top 0.254: v80.01,26.67 78.23,28.45 62.23,28.45 61.22,29.46 U$2.13 61.22,29.47 60.2,28.45 50.04,28.45 48.77,29.72 48.77,31.36 R17.1
  Top 0.406: R17.1 48.91,33.39 Q7.2
  Bottom 0.254: v80.01,26.67 80.01,25.4 80.77,24.64 JP19.P$2
N$13
  Top 0.254: R13.2 LED5.C
N$15
  Top 0.406: R43.1 LED9.A
N$16
  Top 0.254: R1.1 32,81.38 Q1.1
N$17
  Top 0.254: R20.1 LED7.A
N$18
  Top 0.254: R21.1 LED8.A
N$19
  Top 0.254: LED10.A R22.1
N$20
  Top 0.254: R3.1 35.81,81.38 Q2.1
N$21
  Top 0.254: R4.1 39.62,81.38 Q3.1
N$22
  Top 0.254: R5.1 47.24,81.38 Q4.1
N$23
  Top 0.254: R6.1 43.43,81.38 Q5.1
N$24  (via drill 0.6)
  Top 0.254: v27.18,85.09 27.18,87.38 28.19,88.39 32.13,88.39 32.77,89.03 32.77,99.19 34.42,100.84 63.63,100.84 64.9,99.57 64.9,98.7 CASE1.31
  Bottom 0.254: R12.2 20.7,82.8 22.61,84.71 26.8,84.71 v27.18,85.09
N$25
  Top 0.305: LED3.A R24.1
N$26
  Bottom 0.254: U5.3 20.51,77.8 R12.1 23.26,77.99 C6.1
N$31
  Top 0.406: R25.1 64.36,74.31 TX2.A
N$32
  Top 0.406: R23.1 RX2.A
N$40  (via drill 0.6)
  Top 0.254: U8.17 26.29,58.67 v25.91,58.29
  Bottom 0.254: v25.91,58.29 25.91,58.42 22.86,61.47 17.65,61.47 JP3.4
N$43  (via drill 0.6)
  Top 0.254: U8.16 26.5,59.47 v26.16,59.82
  Bottom 0.254: v26.16,59.82 23.49,62.48 JP3.5
N$46  (via drill 0.6)
  Top 0.254: U8.18 29.5,57.87 v29.84,57.53
  Bottom 0.254: v29.84,57.53 26.92,57.53 26.16,56.77 19.3,56.77 18.67,56.13 14.35,56.13 13.84,55.63 13.84,52.7 14.22,52.32 JP3.1 16,52.45 18.54,52.45 18.91,52.82 R8.1
O1  (via drill 0.6)
  Top 0.254: U7.19 21.83,72.15 22.86,71.12 34.8,71.12 v35.56,70.36 | v36.07,61.98 36.07,64.46 U8.3
  Bottom 0.254: v35.56,70.36 35.56,62.48 v36.07,61.98
O2
  Top 0.254: U7.18 21.18,71.78 22.61,70.36 31.5,70.36 32,69.85 32,64.53 U8.8
O3
  Top 0.254: U7.17 20.53,71.67 22.61,69.6 30.48,69.6 31.24,68.83 31.24,64.49 U8.9
O4
  Top 0.254: U7.16 19.88,71.3 22.35,68.83 29.72,68.83 30.48,68.07 30.48,64.5 U8.10
O5
  Top 0.254: U7.15 19.23,70.94 22.35,67.82 23.88,66.42 24.64,65.66 24.64,61.72 25.4,60.96 27.74,60.96 U8.14
O6
  Top 0.254: U7.14 18.58,70.57 22.1,67.06 23.88,65.41 23.88,58.42 25.15,57.15 27.78,57.15 U8.19
O7
  Top 0.254: U7.13 17.93,69.95 23.37,64.52 23.37,57.91 25.15,56.26 27.71,56.26 U8.20
O8
  Top 0.254: U7.12 17.28,69.84 22.86,64.26 22.86,57.66 25.02,55.5 27.83,55.5 U8.21
POS-SWITCH  (1 unrouted)
PWSL
  Top 0.61: Q3.3 40.64,83.82 38.73,85.72 38.73,92.84 CASE1.20
RS-A
  Top 0.254: U2.6 68.71,85.85 69.72,86.87 76.2,86.87 77.6,88.27 77.6,97.03 78.1,97.54 84.33,97.54 85.09,96.77 91.82,96.77 92.58,97.54 92.58,98.6 CASE1.43
  Bottom 0.406: R32.1 85.53,100.64 85.98,101.09 91.95,101.09 92.58,100.46 92.58,98.75 CASE1.43
RS-B
  Top 0.254: U2.7 67.44,86.23 68.71,87.5 75.69,87.5 76.84,88.65 76.84,97.41 77.98,98.55 88.57,98.55 CASE1.40
  Bottom 0.406: R32.2 88.7,98.64 CASE1.40
RX1
  Top 0.254: U8.1 38.31,64.47 39.88,66.04 54.86,66.04 58.67,69.85 58.67,78.74 59.18,79.25 61.54,79.25 61.8,78.99 61.82,78.99 RX2.C 61.92,76.66 62.89,76.66 63.07,76.48 63.07,75.79 63.47,75.39 65.84,75.39 66.17,75.72 U2.1
RX2  (via drill 0.6)
  Top 0.254: Q8.3 53.85,39.12 53.34,39.62 51.93,39.62 | 51.93,39.62 R18.1 | 51.93,39.62 51.93,41.76 LED7.C 54.07,41.88 54.61,42.42 54.61,62.99 v53.34,64.26 | v36.58,67.56 35.56,67.56 34.54,66.55 34.54,64.56 U8.5 | v57.02,70.23 54.1,67.31 52.2,67.31 v52.13,67.25
  Bottom 0.254: v53.34,64.26 53.34,66.04 v52.13,67.25 51.94,67.44 51.31,68.2 37.08,68.2 v36.58,67.56 | CASE1.45 92.66,89.23 91.19,87.76 59.05,87.76 56.77,85.47 56.77,70.48 v57.02,70.23
SCL  (via drill 0.6)
  Top 0.254: U8.37 42.47,57.07 v42.54,57.15 43.18,57.78 45.07,57.78 R7.1
  Bottom 0.254: CASE1.26 48.51,93.73 49.4,92.84 53.72,92.84 54.23,92.33 54.23,69.09 57.15,66.17 57.15,59.69 55.75,58.29 43.69,58.29 v42.54,57.15
SDA  (via drill 0.6)
  Top 0.254: U8.42 48.02,61.07 48.77,60.33 R2.1 | 48.91,57.91 R2.1 | v51.94,57.15 51.94,57.4 51.56,57.78 48.78,57.78 R2.1
  Bottom 0.254: CASE1.25 48.89,98.68 50.93,96.65 53.72,96.65 54.86,95.5 54.86,70.23 57.78,67.31 57.78,59.18 55.75,57.15 v51.94,57.15
START
  Top 0.254: U7.6 19.23,80.72 20.19,79.76 23.49,79.76 24.38,80.64 24.38,86.61 22.22,88.77 19.18,88.77 18.8,89.15 18.8,98.3 18.41,98.68 CASE1.10
TALK  (via drill 0.6)
  Top 0.254: U7.8 17.93,83.79 v17.02,84.71
  Bottom 0.254: v17.02,84.71 17.78,83.95 19.43,83.95 20.45,84.96 20.45,86.23 20.95,86.74 51.94,86.74 52.45,87.25 52.45,90.68 CASE1.30
TX1  (via drill 0.5)
  Top 0.254: U8.44 39.45,64.86 40.13,65.53 55.12,65.53 59.44,69.85 59.44,77.72 v59.94,78.23 | TX2.C 64.41,78.74 v64.16,78.99 64.31,79.15 64.31,80.01 64.75,80.44 69.47,80.44 69.98,79.93 U2.4
  Bottom 0.254: v59.94,78.23 63.91,78.23 64.16,78.49 v64.16,78.99
TX2  (via drill 0.6)
  Top 0.254: Q7.3 48.01,39.12 48.51,39.62 49.67,39.62 | 49.67,39.62 R16.1 | 49.67,39.62 49.67,41.76 LED8.C 48.29,41.88 47.5,42.67 47.5,50.04 49.02,51.56 53.09,51.56 53.85,52.32 53.85,61.47 v53.09,62.23 | v38.1,66.8 37.85,66.55 35.81,66.55 35.31,66.04 35.31,64.53 U8.4 | v55.88,71.5 55.88,70.74 53.97,68.83 51.18,68.83 v49.66,67.31
  Bottom 0.254: v53.09,62.23 52.83,62.23 51.56,63.5 51.56,66.29 50.55,67.31 v49.66,67.31 48.39,67.31 38.61,67.31 v38.1,66.8 | CASE1.46 96.62,97.64 95.63,96.65 91.19,96.65 90.93,96.39 90.93,89.53 89.92,88.52 58.55,88.52 55.88,85.85 v55.88,71.5
U2-RE/DE  (via drill 0.6)
  Top 0.254: U2.2 U2.3 68.76,77.93 v68.76,75.79 | U8.43 51.21,61.87 v52.27,60.81 | v55.65,61.39 58.17,61.39 60.1,63.32 67.08,63.32 v67.67,63.91
  Bottom 0.254: v52.27,60.81 55.07,60.81 v55.65,61.39 | v67.67,63.91 69.22,63.91 70.64,65.33 70.64,73.91 v68.76,75.79
VOL  (via drill 0.6)
  Top 0.254: v31.24,59.44 31.24,55.63 30.48,54.86 30.48,52.9 U8.24
  Bottom 0.254: R15.2 26.54,67.44 27.05,66.93 27.05,65.15 27.69,64.52 27.69,59.56 28.07,59.18 30.99,59.18 v31.24,59.44
  Bottom 0.406: R15.2 20.43,69.57 C8.1 20.41,71.21 20.45,71.25 | U5.1 17.56,75.21 17.14,74.8 17.14,71.5 17.4,71.25 20.45,71.25 | 20.45,71.25 20.45,72.55 U5.4

### Text on the board
tNames: RJ
_tsilk: L1 | V1 | L2 | Q6 | Q1 | Q2 | Q3 | Q5 | Q4 | C40 | U2 | U7 | R43 | LED9 | D1 | + | R9 | R1 | R3 | R4 | R6 | R5 | C7 | RX2 | R23 | R25 | TX2 | C1 | R24 | + | IC1 | U8 | LED3 | C4 | C80 | RJ | U4 | R7 | R2 | R13 | LED1 | R22 | R11 | LED10 | + | LED4 | JP3 | R10 | + | LED5 | R21 | R20 | "DDS" / Dashboard Display System | LED8 | LED7 | R16 | R18 | Q7 | Q8 | R17 | R19 | GRN | DTR | TXO | RXI | VCC | CTS | C5 | GND | BLK | IC2
_bsilk: R32 | R12 | C6 | U5 | C9 | C8 | R15 | C3 | C2 | R8 | C11 | C10 | R14